# Altium schematic sheet Description+Errata.SchDoc: Errata and Table of Contents
size 279 x 215 mm; DrawnBy: Connor Dack; Engineer: Connor Dack; DocumentNumber: 1; Revision: 1.0; SheetNumber: 1; SheetTotal: 11
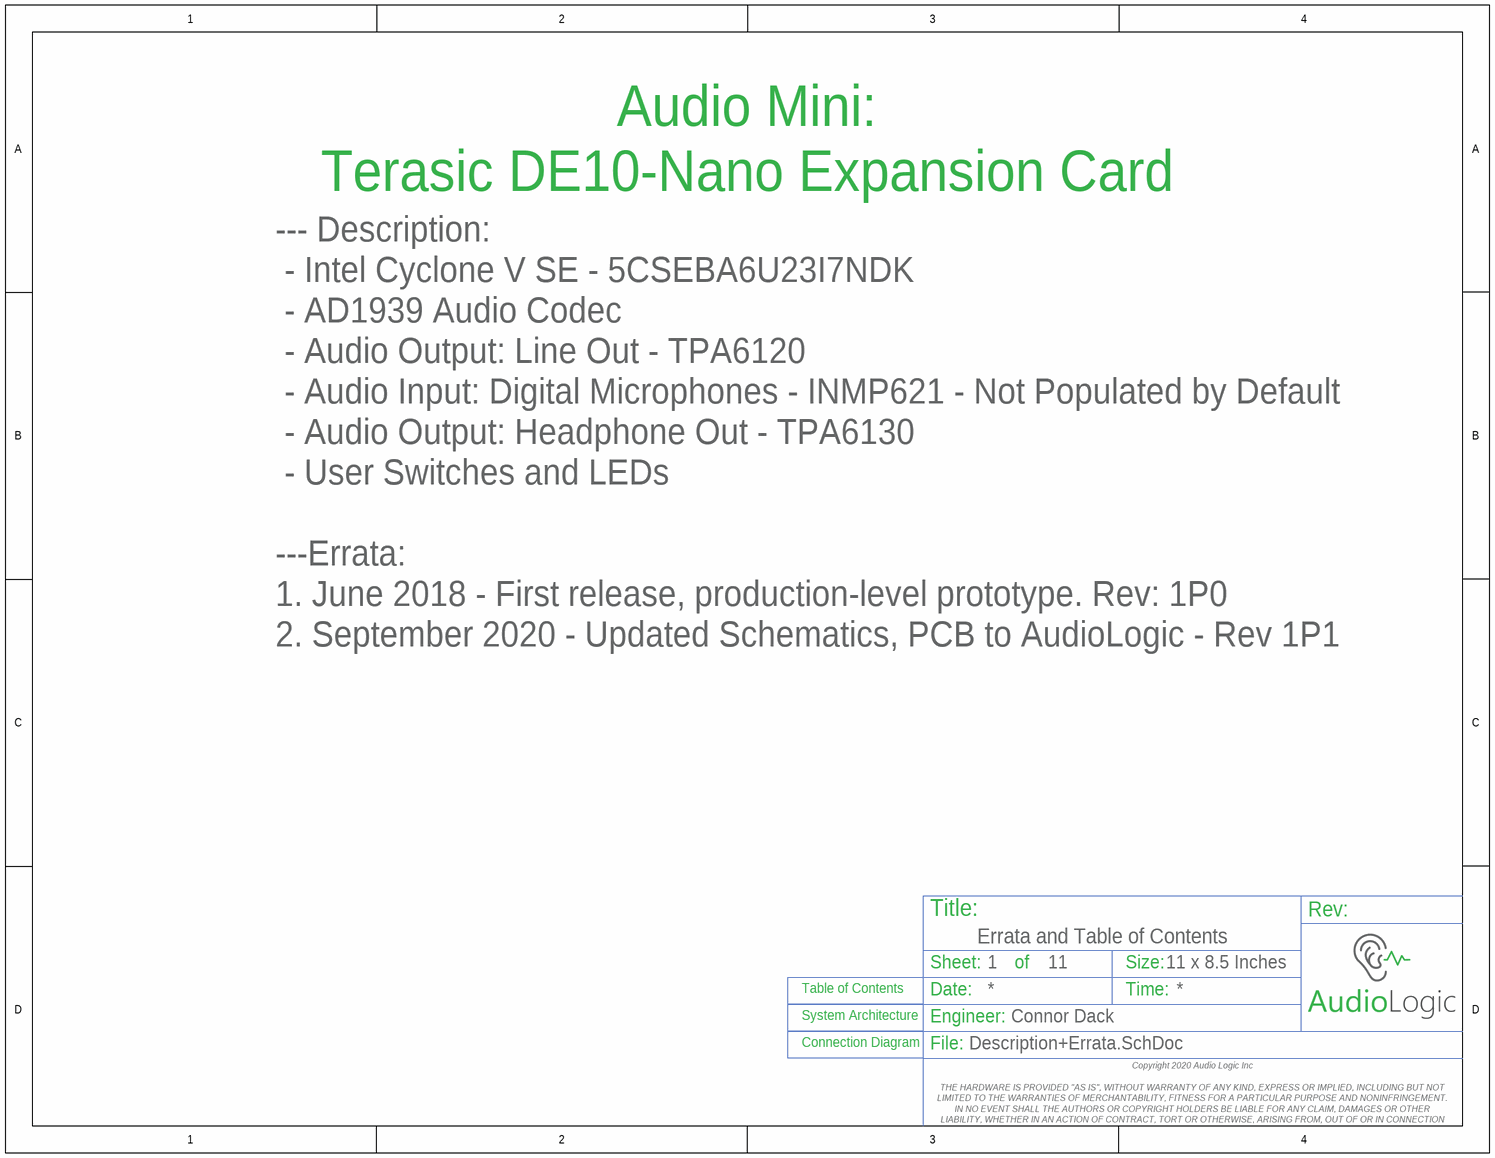
[diagram p0: Description+Errata.SchDoc]

## Sub-sheets
Connection Diagram = TopLevel.SchDoc: no entries
System Architecture = System_Architecture.SchDoc: no entries
Table of Contents = ToC.SchDoc: no entries

## Notes on the sheet
- Audio Mini:
  Terasic DE10-Nano Expansion Card
- --- Description:
  - Intel Cyclone V SE - 5CSEBA6U23I7NDK
  - AD1939 Audio Codec
  - Audio Output: Line Out - TPA6120
  - Audio Input: Digital Microphones - INMP621 - Not Populated by Default
  - Audio Output: Headphone Out - TPA6130
  - User Switches and LEDs
  ---Errata:
  1. June 2018 - First release, production-level prototype. Rev: 1P0
  2. September 2020 - Updated Schematics, PCB to AudioLogic - Rev 1P1
- Title:
- Sheet:
- of
- Size:
- 11 x 8.5 Inches
- Rev:
- Date:
- Engineer:
- Time:
- File:
- Copyright 2020 Audio Logic Inc
  THE HARDWARE IS PROVIDED "AS IS", WITHOUT WARRANTY OF ANY KIND, EXPRESS OR IMPLIED, INCLUDING BUT NOT LIMITED TO THE WARRANTIES OF MERCHANTABILITY, FITNESS FOR A PARTICULAR PURPOSE AND NONINFRINGEMENT. IN NO EVENT SHALL THE AUTHORS OR COPYRIGHT HOLDERS BE LIABLE FOR ANY CLAIM, DAMAGES OR OTHER LIABILITY, WHETHER IN AN ACTION OF CONTRACT, TORT OR OTHERWISE, ARISING FROM, OUT OF OR IN CONNECTION WITH THE HARDWARE OR THE USE OR OTHER DEALINGS IN THE HARDWARE.